# Altium project BrushedMotor.PrjPcb
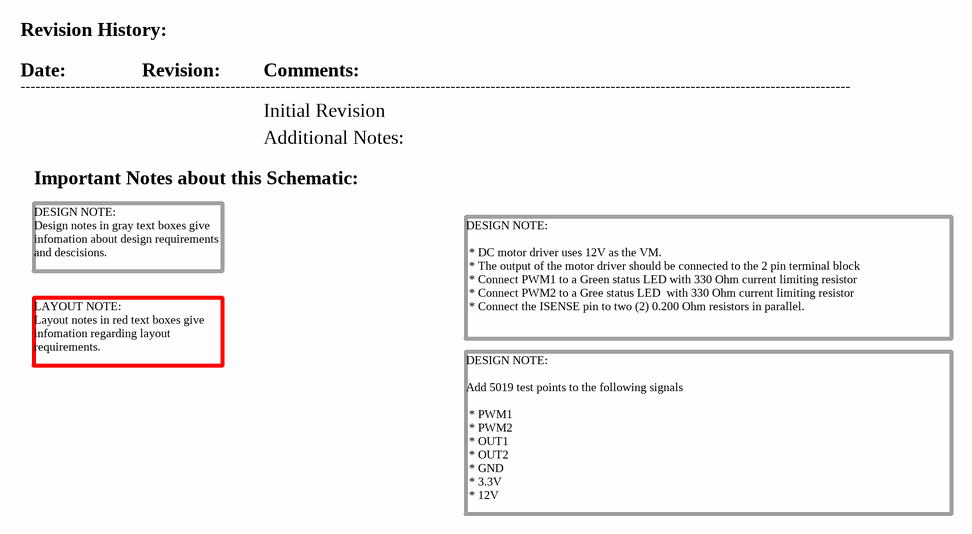
[diagram p0: 01-Revision_History_and_Contents.SchDoc]
3 sheets, 21 parts. Net scope: global (net labels, ports and power ports of the same name join across sheets).
Board file: ECE453-BrushedDCMotor.PcbDoc
Sheets:
  01-Revision_History_and_Contents.SchDoc
  02_Connectors.SchDoc
  03_ICs.SchDoc

## Sheet 01-Revision_History_and_Contents.SchDoc: Revision History and Table of Contents
size A; Revision: A; SheetNumber: 1; SheetTotal: 4; ECE315_Project_Name: S25 Brushed DC Motor - Student

### Notes on the sheet
- Revision History:
- Date:
- ----------------------------------------------------------------------------------------------------------------------------------------------------------------------
- Revision:
- Comments:
- Initial Revision
- Important Notes about this Schematic:
- Additional Notes:
- DESIGN NOTE:
  Design notes in gray text boxes give infomation about design requirements and descisions.
- LAYOUT NOTE:
  Layout notes in red text boxes give infomation regarding layout requirements.
- DESIGN NOTE:
  * DC motor driver uses 12V as the VM.
  * The output of the motor driver should be connected to the 2 pin terminal block
  * Connect PWM1 to a Green status LED with 330 Ohm current limiting resistor
  * Connect PWM2 to a Gree status LED  with 330 Ohm current limiting resistor
  * Connect the ISENSE pin to two (2) 0.200 Ohm resistors in parallel.
- DESIGN NOTE:
  Add 5019 test points to the following signals
  * PWM1
  * PWM2
  * OUT1
  * OUT2
  * GND
  * 3.3V
  * 12V
- Title:
- Size:
- A
- Project
- Rev:
- Sheet:
- of
- College of Engineering
- 1415 Engineering Drive
- Madison, WI 53706

## Sheet 02_Connectors.SchDoc: Off Board Connectors
size A; Revision: A; SheetNumber: 2; SheetTotal: 4; ECE315_Project_Name: S25 Brushed DC Motor - Student
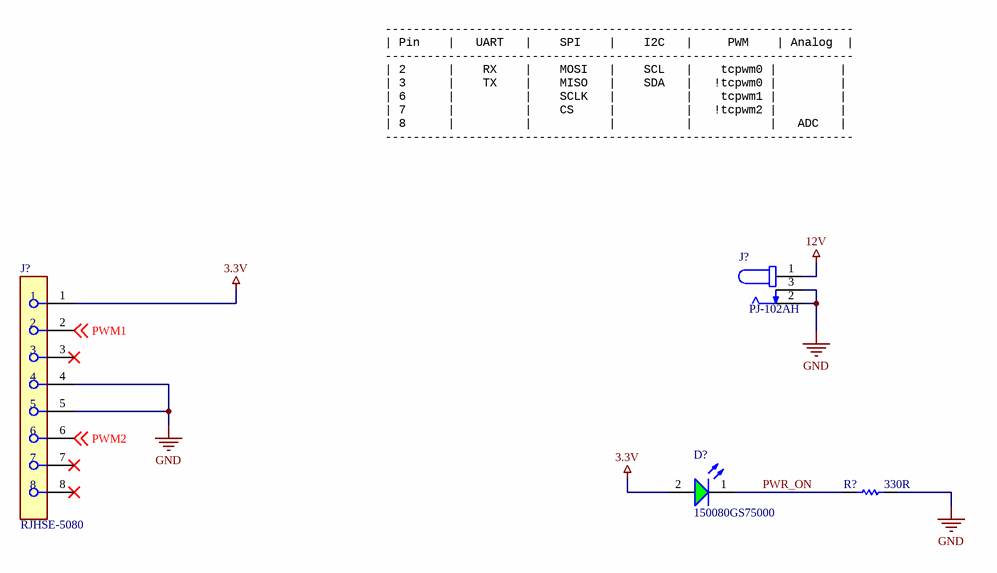
[diagram p1: 02_Connectors.SchDoc]

### Parts
(Parts that share a designator on the sheet are numbered #1, #2 ... from top to bottom, then left to right.)
D?#1  150080GS75000  [WL-SMCW_0805_150080xx75000]
J?#1  MP: PJ-102AH  [CUI_PJ-102AH]  (hidden comment: CONN_PJ-102AH)
J?#2  RJHSE-5080  [FP-RJHSE-5080-MFG]
R?#1  value 330R  [RESC2013X60X40LL20T25]  (hidden comment: ERA6AEB331V)

### Nets
3.3V: D?#1.2(A) J?#2.1
12V: J?#1.1
GND: J?#1.2 J?#1.3 J?#2.4 J?#2.5 R?#1.1
PWM1: J?#2.2 ; off-sheet PWM1
PWM2: J?#2.6 ; off-sheet PWM2
PWR_ON: D?#1.1(K) R?#1.2

Not connected (* = marked no-connect by the designer): J?#2 3* 7* 8*

### Notes on the sheet
- -------------------------------------------------------------------
  | Pin    |   UART   |    SPI    |    I2C   |     PWM    | Analog  |
  -------------------------------------------------------------------
  | 2      |    RX    |    MOSI   |    SCL   |    tcpwm0 |         |
  | 3      |    TX    |    MISO   |    SDA   |   !tcpwm0 |         |
  | 6      |          |    SCLK   |          |    tcpwm1 |         |
  | 7      |          |    CS     |          |   !tcpwm2 |         |
  | 8      |          |           |          |           |   ADC   |
  -------------------------------------------------------------------
- Title:
- Size:
- A
- Project
- Rev:
- Sheet:
- of
- College of Engineering
- 1415 Engineering Drive
- Madison, WI 53706

### Library data of the parts
D?#1 = CMP-1426-00007-2: LED GREEN CLEAR 0805 SMD; NexarPartId: 29717780; Manufacturer: Wurth Electronics; Wavelength: 520nm; Forward Current: 100mA; Lens Style: Clear, Rectangular; Dominant Wavelength: 525nm; Max Junction Temperature (Tj): 95°C; Power Dissipation: 105mW; Luminous Intensity: 450mcd; Peak Wavelength: 515nm; Viewing Angle: 140°; Test Current: 20mA; Reverse Voltage: 5V; Forward Voltage: 3.2V; Lens Color: Colorless; Lens Size: 1.25mm; Mount: Surface Mount; REACH SVHC: Unknown; Min Operating Temperature: -40°C; Case Code (Imperial): 0805; Case/Package: 0805; Max Operating Temperature: 85°C; RoHS: Compliant; Length: 2mm; Height: 700µm; Width: 1.25mm; Color: Green; Case Code (Metric): 2012; Packaging: Tape and Reel; Max Reverse Voltage (DC): 5V; Supplier: Digikey; Supplier Part Number: 732-4983-1-ND; Manufacturer Part Number: 150080GS75000; Category: LEDs; Stock: 34895; Pricing: 1=0.19, 50=0.176, 100=0.151, 500=0.131 (USD); Mounting Technology: Surface Mount; Package Quantity: 1; Series: WL-SMCW; Lens Transparency: Clear; RoHS Compliant: Yes; Reach SVHC Compliant: Unknown; ComponentLink1URL: https://datasheet.ciiva.com/29563/150080gs75000-29563008.pdf?src-supplier=Digikey; ComponentLink1Description: https://datasheet.ciiva.com/29563/150080gs75000-29563008.pdf?src-supplier=Digikey; ComponentLink2URL: https://datasheet.ciiva.com/29279/759434-da-01-en-chipled-0805-w-kl-gruen-150080gs75000-29279039.pdf?src-supplier=Conrad; ComponentLink2Description: https://datasheet.ciiva.com/29279/759434-da-01-en-chipled-0805-w-kl-gruen-150080gs75000-29279039.pdf?src-supplier=Conrad
J?#1 = CONN_PJ-102AH: 2.0 x 6.5 mm, 5.0 A, Horizontal, Through Hole, Tapered Pins, Dc Power Jack Connector; Manufacturer: CUI; MF: {'manufacturer': u'CUI Devices'}; Number of Conductors: 2; Shielding: Unshielded; Package: None; Price: None; Value: *; Availability: Unavailable; Supplier 1: Digikey; Supplier Part Number 1: CP-102AH-ND; Manufacturer Part Number: PJ-102AH; RoHS: Yes; Category: Uncategorized; Stock: 76168; Pricing: 1=0.700000, 10=0.590000, 25=0.566000, 40=0.553750, 200=0.529750, 400=0.481600, 600=0.433430, 1000=0.385280, 2400=0.349160 (USD); Orientation: Horizontal; Packaging: Bulk; Termination: Through Hole; Connector Type: Jack; Diameter: 2.1mm; Lead Free: Lead Free; RoHS Compliant: Yes; ComponentLink1URL: http://www.mouser.com/ds/2/670/PJ-102AH-524179.pdf?src-supplier=Mouser; ComponentLink1Description: http://www.mouser.com/ds/2/670/PJ-102AH-524179.pdf?src-supplier=Mouser; ComponentLink2URL: https://www.cui.com/product/resource/digikeypdf/pj-102ah.pdf?src-supplier=Digikey; ComponentLink2Description: https://www.cui.com/product/resource/digikeypdf/pj-102ah.pdf?src-supplier=Digikey; ComponentLink3URL: http://www.cui.com/Product/Resource/FuturePDF/PJ-102AH.pdf?src-supplier=Future+Electronics; ComponentLink3Description: http://www.cui.com/Product/Resource/FuturePDF/PJ-102AH.pdf?src-supplier=Future+Electronics
J?#2 = CMP-02366-000003-1: CONN MOD JACK 8P8C R/A UNSHLD; Manufacturer: Amphenol; Current Rating: 1.5A; Voltage Rating: 125V; Pitch: 1.02mm; Conn Orientation: Right Angle; Number Of Contacts: 8; Is Female: yes; Conn Gender: Female; Contact Resistance: 20mR; Number of Ports: 1; Connector Type: RJ45; Lead Free: Yes; Device Class L3: unset; Footprint Url: https://cdn.amphenol-icc.com/media/wysiwyg/files/drawing/rjhse5080.pdf?__cf_chl_jschl_tk__=e349db0bbbb6188a39347cd5e541b92fa02c9719-1587748343-0-AW7tChdeHzRPLX9gSWj7WrKaXQoY9BsmT9Ek0h-T62M9y3Rs9iypFcOtkzb-6sGYQEjFE-jcoNciDETCOZrh1rYyOesac5SvYLoLwHIsHvF4AKBlx-MXmfZUVk9OTTJLqyQq2qMm0PFRLJpNcK0nrKResqOniRSYixG2sPTmOPraH-ULJFBDL602CHqcI9KKBgTq90Jh1OL2Td4moJ99rFsJRJ1Tk_uoxGe8ublcP_ARu-uLpWcQrBcwOcHDTAwL29DAwVaqcH7ta8Ks7WMlHmVl_pILeEDwT0bE9vu5Pa5S3PtNRF1leuFkgi_FMbUxTDulc5xzbXSfng8srUIV1lWXny5nx1fZJEUa_w97yKjffzBMxiWLWVN-V7-uqAaPbyv_m-wRyw5O25OZNyJOeGU; ComponentLink2URL: https://cdn.amphenol-icc.com/media/wysiwyg/files/documentation/datasheet/inputoutput/io-modjack-rjhse.pdf; Device Class L1: Connectors; Package: CONN_MOD_JACK; Mouser Description: Modular Connectors / Ethernet Connectors R/A RJ45 NONSHIELDED 8 CONT NO LEDS; Manufacturer Part Number: RJHSE-5080; Octopart: https://octopart.com/rjhse-5080-amphenol-45060; Category: Conn; Height: 0.535inch; Temperature: -55°C to +85°C; Digikey Description: CONN MOD JACK 8P8C R/A UNSHLD; Device Class L2: Modular / Ethernet Connectors; Contact Material: Gold,Nickel; ComponentLink2Description: Datasheet; Temperature Range Low: -55°C; RoHS: TRUE; Automotive: No; Temperature Range High: +85°C; Supplier: Digikey; Supplier Part Number: RJHSE-5080-ND; Stock: 72112; Pricing: 1=1.03, 10=0.867, 25=0.832, 50=0.8142, 100=0.7788, 250=0.708, 500=0.6372, 1000=0.56641, 2500=0.51331 (USD); Mounting Technology: Through Hole,Panel; Contact Plating: Gold; Max Current Rating: 1.5A; Number of Positions Loaded: 8; Max Voltage Rating (AC): 125V; Orientation: Right Angle; Packaging: Rail/Tube; Gender: Female; Termination: Solder; Number of Positions: 8; Voltage Rating (DC): 125V; Length: 15.75mm; Depth: 14.99mm; Radiation Hardening: No; RoHS Compliant: Yes; Reach SVHC Compliant: Unknown; ComponentLink1URL: https://datasheet.ciiva.com/7629/1682821-7629402.pdf?src-supplier=Element14; ComponentLink1Description: https://datasheet.ciiva.com/7629/1682821-7629402.pdf?src-supplier=Element14; ComponentLink3URL: https://datasheet.ciiva.com/1432/1693748-1432448.pdf?src-supplier=Element14; ComponentLink3Description: https://datasheet.ciiva.com/1432/1693748-1432448.pdf?src-supplier=Element14
R?#1 = CMP-2001-00628-1: RES SMD 330 OHM 1% 1/8W 0805; Manufacturer: Panasonic; Manufacturer Part Number: ERJ-6ENF3300V; Voltage Rating: 150V; Power Rating: 125mW; Temperature Coefficient: 100ppm/°C; ComponentLink1URL: https://datasheet.ciiva.com/11808/0900766b80eb1d8c-11808093.pdf?src-supplier=Rs; ComponentLink1Description: https://datasheet.ciiva.com/11808/0900766b80eb1d8c-11808093.pdf?src-supplier=Rs; ComponentLink2URL: https://datasheet.ciiva.com/29184/452857-da-01-en-widerstand-0805-era-29184079.pdf?src-supplier=Conrad; ComponentLink2Description: https://datasheet.ciiva.com/29184/452857-da-01-en-widerstand-0805-era-29184079.pdf?src-supplier=Conrad; ComponentLink3URL: https://datasheet.ciiva.com/9182/aoa0000ce26-9182968.pdf?src-supplier=Avnet; ComponentLink3Description: https://datasheet.ciiva.com/9182/aoa0000ce26-9182968.pdf?src-supplier=Avnet; ComponentLink4URL: https://datasheet.ciiva.com/48536/era-eng-tds-48536857.pdf?src-supplier=Distrelec; ComponentLink4Description: https://datasheet.ciiva.com/48536/era-eng-tds-48536857.pdf?src-supplier=Distrelec; ComponentLink5URL: https://datasheet.ciiva.com/22759/485442-22759176.pdf?src-supplier=Farnell; ComponentLink5Description: https://datasheet.ciiva.com/22759/485442-22759176.pdf?src-supplier=Farnell; ComponentLink6URL: https://datasheet.ciiva.com/6138/485442-6138589.pdf?src-supplier=Farnell; ComponentLink6Description: https://datasheet.ciiva.com/6138/485442-6138589.pdf?src-supplier=Farnell; ComponentLink7URL: https://datasheet.ciiva.com/43457/485442-43457816.pdf?src-supplier=Farnell; ComponentLink7Description: https://datasheet.ciiva.com/43457/485442-43457816.pdf?src-supplier=Farnell; ComponentLink8URL: https://datasheet.ciiva.com/6138/485442-6138585.pdf?src-supplier=Farnell; ComponentLink8Description: https://datasheet.ciiva.com/6138/485442-6138585.pdf?src-supplier=Farnell; ComponentLink9URL: https://datasheet.ciiva.com/24164/aoa0000ce26-197354-24164407.pdf?src-supplier=Mouser; ComponentLink9Description: https://datasheet.ciiva.com/24164/aoa0000ce26-197354-24164407.pdf?src-supplier=Mouser; ComponentLink10URL: https://datasheet.ciiva.com/22744/1776116-22744153.pdf?src-supplier=Element14; ComponentLink10Description: https://datasheet.ciiva.com/22744/1776116-22744153.pdf?src-supplier=Element14; ComponentLink11URL: https://datasheet.ciiva.com/46436/485442-46436606.pdf?src-supplier=Element14; ComponentLink11Description: https://datasheet.ciiva.com/46436/485442-46436606.pdf?src-supplier=Element14; ComponentLink12URL: https://datasheet.ciiva.com/16777/70068849-16777611.pdf?src-supplier=Allied+Electronics; ComponentLink12Description: https://datasheet.ciiva.com/16777/70068849-16777611.pdf?src-supplier=Allied+Electronics; ComponentLink13URL: https://datasheet.ciiva.com/30237/54aoa0000ce26-30237450.pdf?src-supplier=Onlinecomponents.com; ComponentLink13Description: https://datasheet.ciiva.com/30237/54aoa0000ce26-30237450.pdf?src-supplier=Onlinecomponents.com; ComponentLink14URL: https://datasheet.ciiva.com/11821/0900766b80f80784-11821635.pdf?src-supplier=Rs; ComponentLink14Description: https://datasheet.ciiva.com/11821/0900766b80f80784-11821635.pdf?src-supplier=Rs; ComponentLink15URL: https://datasheet.ciiva.com/24025/aoa0000ce2-24025991.pdf?src-supplier=Mouser; ComponentLink15Description: https://datasheet.ciiva.com/24025/aoa0000ce2-24025991.pdf?src-supplier=Mouser; Supplier: Digikey; Supplier Part Number: P330CCT-ND; RoHS: Yes; Category: Chip SMD Resistors; Stock: 40201; Pricing: 1=0.11, 10=0.053, 50=0.0344, 100=0.0292, 500=0.02058, 1000=0.01792 (USD); Mounting Technology: Surface Mount; Case/Package: 0805; Pins: 2; Case Code (Imperial): 0805; Case Code (Metric): 2012; Contact Plating: Tin; Min Operating Temperature: -55°C; Max Operating Temperature: 155°C; Packaging: Tape and Reel; Tolerance: 1%; Package Quantity: 1; Resistor Type: Thick Film; Number of Terminations: 2; Termination: SMD/SMT; Max Power Dissipation: 125mW; Series: ERJ; Resistance Tolerance: 1%; Technology: THICK FILM; Construction: Rectangular; Voltage Rating (DC): 150V; Features: Automotive AEC-Q200; Length: 2mm; Width: 1.2mm; Height: 0.6mm; Depth: 1.25mm; Reach SVHC Compliant: No; Military Standard: Not; RoHS Compliant: Yes

## Sheet 03_ICs.SchDoc: ICs
size A; Revision: A; SheetNumber: 3; SheetTotal: 4; ECE315_Project_Name: S25 Brushed DC Motor - Student
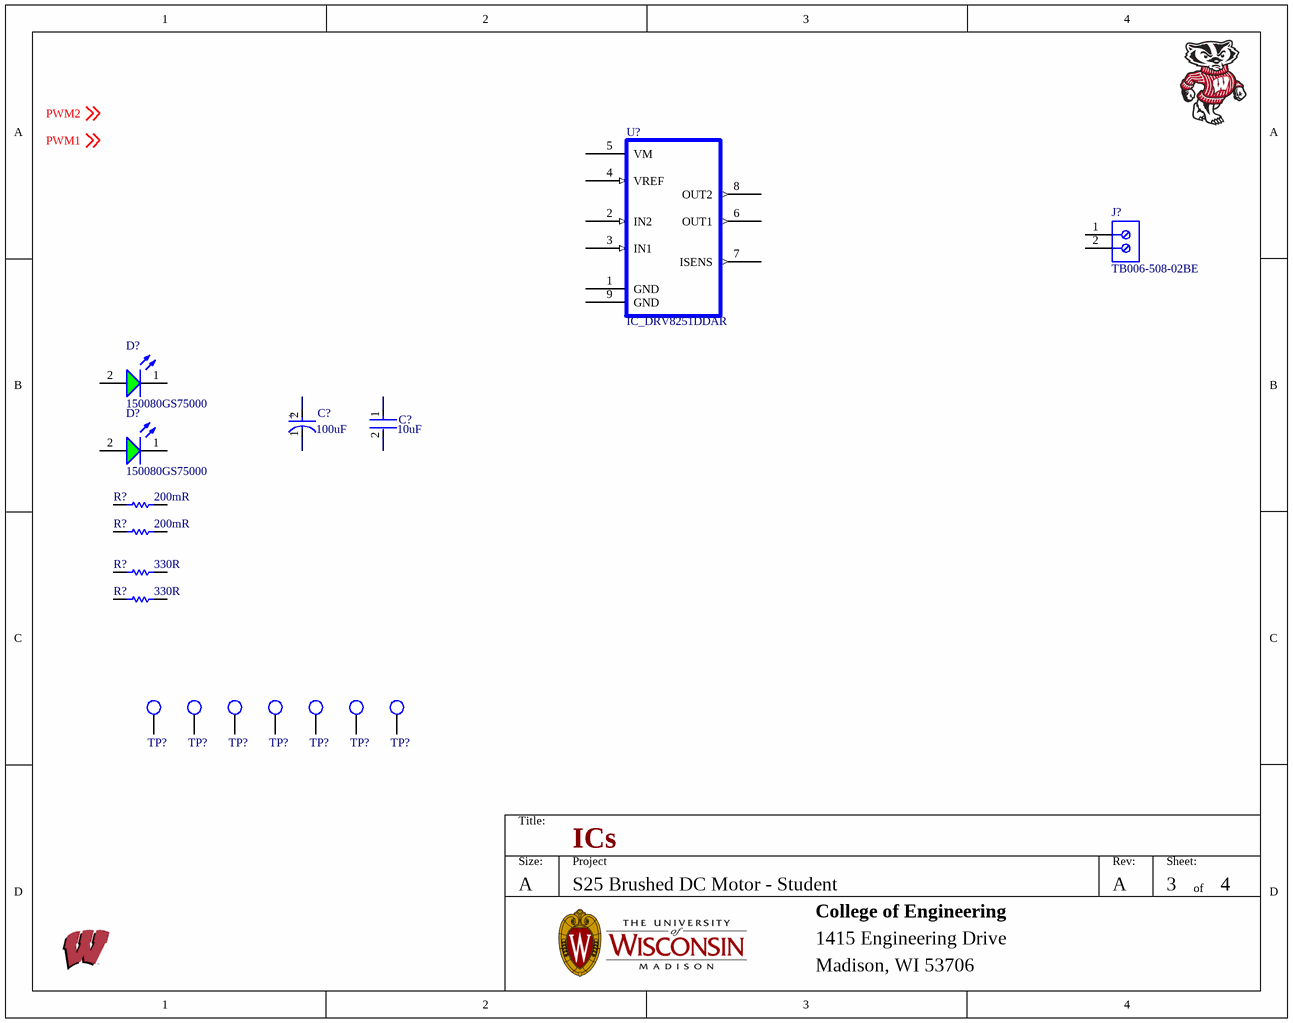
[diagram p2: 03_ICs.SchDoc]

### Parts
(Parts that share a designator on the sheet are numbered #1, #2 ... from top to bottom, then left to right.)
C?#1  value 100uF  [FP-SD8-MFG]  (hidden comment: EEE-1EA101XP)
C?#2  value 10uF  [FP-C0805C-DG-MFG]  (hidden comment: C0805C106K8PACTU)
D?#2  150080GS75000  [WL-SMCW_0805_150080xx75000]
D?#3  150080GS75000  [WL-SMCW_0805_150080xx75000]
J?#3  Manufacturer Part Number: TB006-508-02BE  [CUI_TB006 -508-02BE]  (hidden comment: CONN_TB006_-508-02BE)
R?#2  value 200mR  [RESC2013X60X40LL20T25]  (hidden comment: ERJ-6DSFR20V)
R?#3  value 200mR  [RESC2013X60X40LL20T25]  (hidden comment: ERJ-6DSFR20V)
R?#4  value 330R  [RESC2013X60X40LL20T25]  (hidden comment: ERA6AEB331V)
R?#5  value 330R  [RESC2013X60X40LL20T25]  (hidden comment: ERA6AEB331V)
TP?#1  TP_5019  [FP-5019-MFG]  (value not drawn)
TP?#2  TP_5019  [FP-5019-MFG]  (value not drawn)
TP?#3  TP_5019  [FP-5019-MFG]  (value not drawn)
TP?#4  TP_5019  [FP-5019-MFG]  (value not drawn)
TP?#5  TP_5019  [FP-5019-MFG]  (value not drawn)
TP?#6  TP_5019  [FP-5019-MFG]  (value not drawn)
TP?#7  TP_5019  [FP-5019-MFG]  (value not drawn)
U?  IC_DRV8251DDAR  [SOIC_8_PP]

### Nets

Not connected (* = marked no-connect by the designer): C?#1 1(C) 2(A); C?#2 1 2; D?#2 1(K) 2(A); D?#3 1(K) 2(A); J?#3 1 2; R?#2 1 2; R?#3 1 2; R?#4 1 2; R?#5 1 2; TP?#1 1; TP?#2 1; TP?#3 1; TP?#4 1; TP?#5 1; TP?#6 1; TP?#7 1; U? 1(GND) 2(IN2) 3(IN1) 4(VREF) 5(VM) 6(OUT1) 7(ISENS) 8(OUT2) 9(GND)

### Notes on the sheet
- Labels drawn without touching a wire or pin: PWM1, PWM2
- Title:
- Size:
- A
- Project
- Rev:
- Sheet:
- of
- College of Engineering
- 1415 Engineering Drive
- Madison, WI 53706
- (in symbol CMP-05427-000061-1) +

### Library data of the parts
C?#1 = CMP-05427-000061-1: CAP ALUM 100UF 20% 25V SMD; Manufacturer: Panasonic; Leakage Current: 3uA; Life (Hours): 2000Hour; Ripple Current: 143mA; Polarity: Polar; Dissipation Factor: 14%; Height - Seated (Max): 0.303inch; Contact Plating: Tin; Max Operating Temperature: 85°C; Package Quantity: 900; RoHS Compliant: Yes; Termination: SMD/SMT; Lead Free: Lead Free; Min Operating Temperature: -40°C; Radiation Hardening: No; Length: 8mm; Height: 7.7mm; Series: S; Voltage Rating: 25V; Capacitance: 100uF; Diameter: 6.3mm; Ripple Current (AC): 143mA; Case/Package: Radial; Packaging: Tape and Reel; Voltage: 25V; Tolerance: 20%; Construction: Cylindrical; Voltage Rating (DC): 25V; Mount: Surface Mount; Supplier: Digikey; Supplier Part Number: PCE3898CT-ND; Manufacturer Part Number: EEE-1EA101XP; RoHS: Yes; Category: Aluminum Electrolytic Capacitors; Stock: 41776; Pricing: 1=0.51, 10=0.338, 50=0.2488, 100=0.2025 (USD); Mounting Technology: Surface Mount,PCB; Ratings: AEC-Q200; Reach SVHC Compliant: Unknown; ComponentLink1URL: https://datasheet.ciiva.com/30108/11aba0000ce2-30108047.pdf?src-supplier=Onlinecomponents.com; ComponentLink1Description: https://datasheet.ciiva.com/30108/11aba0000ce2-30108047.pdf?src-supplier=Onlinecomponents.com; ComponentLink2URL: https://datasheet.ciiva.com/16201/aba0000ce2-16201065.pdf?src-supplier=Future+Electronics; ComponentLink2Description: https://datasheet.ciiva.com/16201/aba0000ce2-16201065.pdf?src-supplier=Future+Electronics; ComponentLink3URL: https://datasheet.ciiva.com/24022/aba0000ce2-40801-24022875.pdf?src-supplier=Mouser; ComponentLink3Description: https://datasheet.ciiva.com/24022/aba0000ce2-40801-24022875.pdf?src-supplier=Mouser
C?#2 = CMP-2007-03243-2: CAP CER 10UF 10V X5R 0805; Manufacturer: KEMET; Dielectric Material: Ceramic; Material: 4241ConductorMaterial; Tolerance: 10%; ComponentLink2URL: https://content.kemet.com/datasheets/KEM_C1006_X5R_SMD.pdf; ComponentLink2Description: Datasheet; Supplier: Digikey; Supplier Part Number: 399-C0805C106K8PAC7800CT-ND; Manufacturer Part Number: C0805C106K8PACTU; RoHS: Yes; Category: Ceramic Capacitors; Stock: 5202928; Pricing: 1=0.14, 10=0.098, 50=0.0584, 100=0.0459, 500=0.03388, 1000=0.02805 (USD); Mounting Technology: Surface Mount; Case/Package: 0805; Pins: 2; Contact Plating: Tin,Matte; Case Code (Imperial): 0805; Case Code (Metric): 2012; Min Operating Temperature: -55°C; Max Operating Temperature: 85°C; Packaging: Tape and Reel; Dielectric: X5R; Voltage Rating (DC): 10V; Termination: SMD/SMT; Package Quantity: 1; Voltage Rating: 10V; Voltage: 10V; Dissipation Factor: 10%; Series: C; Construction: Flat; Length: 2mm; Width: 0.049inch; Height: 1.25mm; Depth: 1.25mm; Thickness: 0.055inch; Radiation Hardening: No; Reach SVHC Compliant: No; Lead Free: Lead Free; RoHS Compliant: Yes; ComponentLink1URL: https://datasheet.ciiva.com/22704/1732709-22704859.pdf?src-supplier=Element14; ComponentLink1Description: https://datasheet.ciiva.com/22704/1732709-22704859.pdf?src-supplier=Element14; ComponentLink3URL: https://datasheet.ciiva.com/7842/1732709-7842198.pdf?src-supplier=Element14; ComponentLink3Description: https://datasheet.ciiva.com/7842/1732709-7842198.pdf?src-supplier=Element14; ComponentLink4URL: https://datasheet.ciiva.com/7842/40889-7842552.pdf?src-supplier=Element14; ComponentLink4Description: https://datasheet.ciiva.com/7842/40889-7842552.pdf?src-supplier=Element14
D?#2 D?#3 = CMP-1426-00007-2: as D?#1 on sheet 02_Connectors; Mount: Surface Mount; REACH SVHC: Unknown; Min Operating Temperature: -40°C; Case Code (Imperial): 0805; Case/Package: 0805; Max Operating Temperature: 85°C; RoHS: Compliant; Length: 2mm; Height: 700µm; Width: 1.25mm; Color: Green; Case Code (Metric): 2012; Packaging: Tape and Reel; Max Reverse Voltage (DC): 5V; Supplier: Digikey; Supplier Part Number: 732-4983-1-ND; Manufacturer Part Number: 150080GS75000; Category: LEDs; Stock: 34895; Pricing: 1=0.19, 50=0.176, 100=0.151, 500=0.131 (USD); Mounting Technology: Surface Mount; Package Quantity: 1; Series: WL-SMCW; Lens Transparency: Clear; RoHS Compliant: Yes; Reach SVHC Compliant: Unknown; ComponentLink1URL: https://datasheet.ciiva.com/29563/150080gs75000-29563008.pdf?src-supplier=Digikey; ComponentLink1Description: https://datasheet.ciiva.com/29563/150080gs75000-29563008.pdf?src-supplier=Digikey; ComponentLink2URL: https://datasheet.ciiva.com/29279/759434-da-01-en-chipled-0805-w-kl-gruen-150080gs75000-29279039.pdf?src-supplier=Conrad; ComponentLink2Description: https://datasheet.ciiva.com/29279/759434-da-01-en-chipled-0805-w-kl-gruen-150080gs75000-29279039.pdf?src-supplier=Conrad
J?#3 = CONN_TB006_-508-02BE: 2~24 Poles, Screw Type, Horizontal, 5.08 Pitch, 26~14 (AWG), Terminal Block Connector; MF: CUI Devices; MP: TB006 -508-02BE; CUI_purchase_URL: https://www.cuidevices.com/product/interconnect/connectors/terminal-blocks/tb006-508-series?utm_source=snapeda.com&utm_medium=referral&utm_campaign=snapedaBOM; Value: *; Check_prices: https://www.snapeda.com/parts/TB006%20-508-02BE/CUI+Devices/view-part/?ref=eda; SnapEDA_Link: https://www.snapeda.com/parts/TB006%20-508-02BE/CUI+Devices/view-part/?ref=snap; Availability: In Stock; Package: None; Purchase-URL: https://pricing.snapeda.com/search/part/TB006 -508-02BE/?ref=eda; Price: None; Supplier 1: Digikey; Supplier Part Number 1: 102-6191-ND; Manufacturer: CUI Devices; RoHS: Yes; Category: Terminal Blocks; Stock: 47249; Pricing: 1=0.73, 10=0.402, 25=0.3, 50=0.2676, 100=0.2623, 250=0.23084, 500=0.20984, 1000=0.18886, 5000=0.14164 (USD)
R?#2 R?#3 = CMP-2001-00628-1: RES 0.2 OHM 1% 1/2W 0805; Manufacturer: Panasonic; Max Power Dissipation: 500mW; Temperature Coefficient: 150ppm/°C; Supplier: Digikey; Supplier Part Number: P19315CT-ND; Manufacturer Part Number: ERJ-6DSFR20V; RoHS: Yes; Category: Chip SMD Resistors; Stock: 49000; Pricing: 1=0.46, 10=0.314, 25=0.2444, 50=0.18, 100=0.1253, 250=0.1092, 500=0.09004, 1000=0.06514 (USD); Case/Package: 0805; Case Code (Metric): 2012; Case Code (Imperial): 0805; Min Operating Temperature: -55°C; Max Operating Temperature: 155°C; Packaging: Cut Tape; Number of Terminations: 2; Tolerance: 1%; Features: Automotive AEC-Q200; Series: ERJ; Length: 0.079inch; Width: 0.049inch; Height: 0.028inch; ComponentLink1URL: http://www.farnell.com/datasheets/2883947.pdf?src-supplier=Newark; ComponentLink1Description: http://www.farnell.com/datasheets/2883947.pdf?src-supplier=Newark; ComponentLink2URL: https://industrial.panasonic.com/cdbs/www-data/pdf/RDN0000/AOA0000C313.pdf?src-supplier=Digikey; ComponentLink2Description: https://industrial.panasonic.com/cdbs/www-data/pdf/RDN0000/AOA0000C313.pdf?src-supplier=Digikey
R?#4 R?#5 = CMP-2001-00628-1: as R?#1 on sheet 02_Connectors; ComponentLink1URL: https://datasheet.ciiva.com/11808/0900766b80eb1d8c-11808093.pdf?src-supplier=Rs; ComponentLink1Description: https://datasheet.ciiva.com/11808/0900766b80eb1d8c-11808093.pdf?src-supplier=Rs; ComponentLink2URL: https://datasheet.ciiva.com/29184/452857-da-01-en-widerstand-0805-era-29184079.pdf?src-supplier=Conrad; ComponentLink2Description: https://datasheet.ciiva.com/29184/452857-da-01-en-widerstand-0805-era-29184079.pdf?src-supplier=Conrad; ComponentLink3URL: https://datasheet.ciiva.com/9182/aoa0000ce26-9182968.pdf?src-supplier=Avnet; ComponentLink3Description: https://datasheet.ciiva.com/9182/aoa0000ce26-9182968.pdf?src-supplier=Avnet; ComponentLink4URL: https://datasheet.ciiva.com/48536/era-eng-tds-48536857.pdf?src-supplier=Distrelec; ComponentLink4Description: https://datasheet.ciiva.com/48536/era-eng-tds-48536857.pdf?src-supplier=Distrelec; ComponentLink5URL: https://datasheet.ciiva.com/22759/485442-22759176.pdf?src-supplier=Farnell; ComponentLink5Description: https://datasheet.ciiva.com/22759/485442-22759176.pdf?src-supplier=Farnell; ComponentLink6URL: https://datasheet.ciiva.com/6138/485442-6138589.pdf?src-supplier=Farnell; ComponentLink6Description: https://datasheet.ciiva.com/6138/485442-6138589.pdf?src-supplier=Farnell; ComponentLink7URL: https://datasheet.ciiva.com/43457/485442-43457816.pdf?src-supplier=Farnell; ComponentLink7Description: https://datasheet.ciiva.com/43457/485442-43457816.pdf?src-supplier=Farnell; ComponentLink8URL: https://datasheet.ciiva.com/6138/485442-6138585.pdf?src-supplier=Farnell; ComponentLink8Description: https://datasheet.ciiva.com/6138/485442-6138585.pdf?src-supplier=Farnell; ComponentLink9URL: https://datasheet.ciiva.com/24164/aoa0000ce26-197354-24164407.pdf?src-supplier=Mouser; ComponentLink9Description: https://datasheet.ciiva.com/24164/aoa0000ce26-197354-24164407.pdf?src-supplier=Mouser; ComponentLink10URL: https://datasheet.ciiva.com/22744/1776116-22744153.pdf?src-supplier=Element14; ComponentLink10Description: https://datasheet.ciiva.com/22744/1776116-22744153.pdf?src-supplier=Element14; ComponentLink11URL: https://datasheet.ciiva.com/46436/485442-46436606.pdf?src-supplier=Element14; ComponentLink11Description: https://datasheet.ciiva.com/46436/485442-46436606.pdf?src-supplier=Element14; ComponentLink12URL: https://datasheet.ciiva.com/16777/70068849-16777611.pdf?src-supplier=Allied+Electronics; ComponentLink12Description: https://datasheet.ciiva.com/16777/70068849-16777611.pdf?src-supplier=Allied+Electronics; ComponentLink13URL: https://datasheet.ciiva.com/30237/54aoa0000ce26-30237450.pdf?src-supplier=Onlinecomponents.com; ComponentLink13Description: https://datasheet.ciiva.com/30237/54aoa0000ce26-30237450.pdf?src-supplier=Onlinecomponents.com; Supplier: Digikey; Supplier Part Number: P330CCT-ND; RoHS: Yes; Category: Chip SMD Resistors; Stock: 40201; Pricing: 1=0.11, 10=0.053, 50=0.0344, 100=0.0292, 500=0.02058, 1000=0.01792 (USD); Mounting Technology: Surface Mount; Case/Package: 0805; Pins: 2; Case Code (Imperial): 0805; Case Code (Metric): 2012; Contact Plating: Tin; Min Operating Temperature: -55°C; Max Operating Temperature: 155°C; Packaging: Tape and Reel; Tolerance: 1%; Package Quantity: 1; Resistor Type: Thick Film; Number of Terminations: 2; Termination: SMD/SMT; Max Power Dissipation: 125mW; Series: ERJ; Resistance Tolerance: 1%; Technology: THICK FILM; Construction: Rectangular; Voltage Rating (DC): 150V; Features: Automotive AEC-Q200; Length: 2mm; Width: 1.2mm; Height: 0.6mm; Depth: 1.25mm; Reach SVHC Compliant: No; Military Standard: Not; RoHS Compliant: Yes; ComponentLink14URL: https://datasheet.ciiva.com/11821/0900766b80f80784-11821635.pdf?src-supplier=Rs; ComponentLink14Description: https://datasheet.ciiva.com/11821/0900766b80f80784-11821635.pdf?src-supplier=Rs; ComponentLink15URL: https://datasheet.ciiva.com/24025/aoa0000ce2-24025991.pdf?src-supplier=Mouser; ComponentLink15Description: https://datasheet.ciiva.com/24025/aoa0000ce2-24025991.pdf?src-supplier=Mouser
TP?#1-TP?#7 = TP_5019: Test Point, Mini, SMT, Phos Bronze/Silver, 1000pc Tape & Reel | Keystone Electronics 5019; Manufacturer Part Number: 5019; Plating: Silver; Body Material: Bronze; Number of Contacts: 1NUMBER; Supplier 1: Digikey; Supplier Part Number 1: 36-5019CT-ND; Manufacturer: Keystone Electronics; RoHS: Yes; Category: Terminals; Stock: 282853; Pricing: 1=0.37, 25=0.2496, 100=0.2117, 250=0.1902, 500=0.1756, 1000=0.16229, 2000=0.15019, 3000=0.14362, 5000=0.13585, 7000=0.13102, 10000=0.12613, 25000=0.1211 (USD); Mounting Technology: Surface Mount,PCB; Pins: 1; Contact Plating: Silver; Contact Material: Bronze; Material: Bronze; Packaging: Tape and Reel; Package Quantity: 1; Termination: SMD/SMT; Series: 5019; Height: 0.09inch; Reach SVHC Compliant: No; RoHS Compliant: Yes; Lead Free: Lead Free; ComponentLink1URL: https://datasheet.ciiva.com/14848/m60-2p61-14848437.pdf?src-supplier=Digikey; ComponentLink1Description: https://datasheet.ciiva.com/14848/m60-2p61-14848437.pdf?src-supplier=Digikey; ComponentLink2URL: https://datasheet.ciiva.com/14848/m60-2p61-14848438.pdf?src-supplier=Digikey; ComponentLink2Description: https://datasheet.ciiva.com/14848/m60-2p61-14848438.pdf?src-supplier=Digikey; ComponentLink3URL: https://datasheet.ciiva.com/14848/m60-2p61-14848439.pdf?src-supplier=Digikey; ComponentLink3Description: https://datasheet.ciiva.com/14848/m60-2p61-14848439.pdf?src-supplier=Digikey; ComponentLink4URL: https://datasheet.ciiva.com/16885/70182998-16885945.pdf?src-supplier=Allied+Electronics; ComponentLink4Description: https://datasheet.ciiva.com/16885/70182998-16885945.pdf?src-supplier=Allied+Electronics; ComponentLink5URL: https://datasheet.ciiva.com/16318/m60-2p61-16318395.pdf?src-supplier=Future+Electronics; ComponentLink5Description: https://datasheet.ciiva.com/16318/m60-2p61-16318395.pdf?src-supplier=Future+Electronics
U? = IC_DRV8251DDAR: 48-V, 3.5-A H bridge motor driver with current regulation and latched OCP 8-SO PowerPAD -40 to 150; Manufacturer: Texas Instruments; Supplier 1: Digi-Key; Supplier Part Number 1: 296-DRV8251DDARCT-ND; Manufacturer Part Number: DRV8251DDAR; RoHS: No; Category: Integrated Circuits (ICs); Stock: 4730; Pricing: 1=1.66, 10=1.495, 25=1.4108, 100=1.202, 250=1.12868, 500=0.9876, 1000=0.81829 (USD)